# Altium schematic sheet Current Sensing.SchDoc
size A4; SheetNumber: 7; SheetTotal: 7
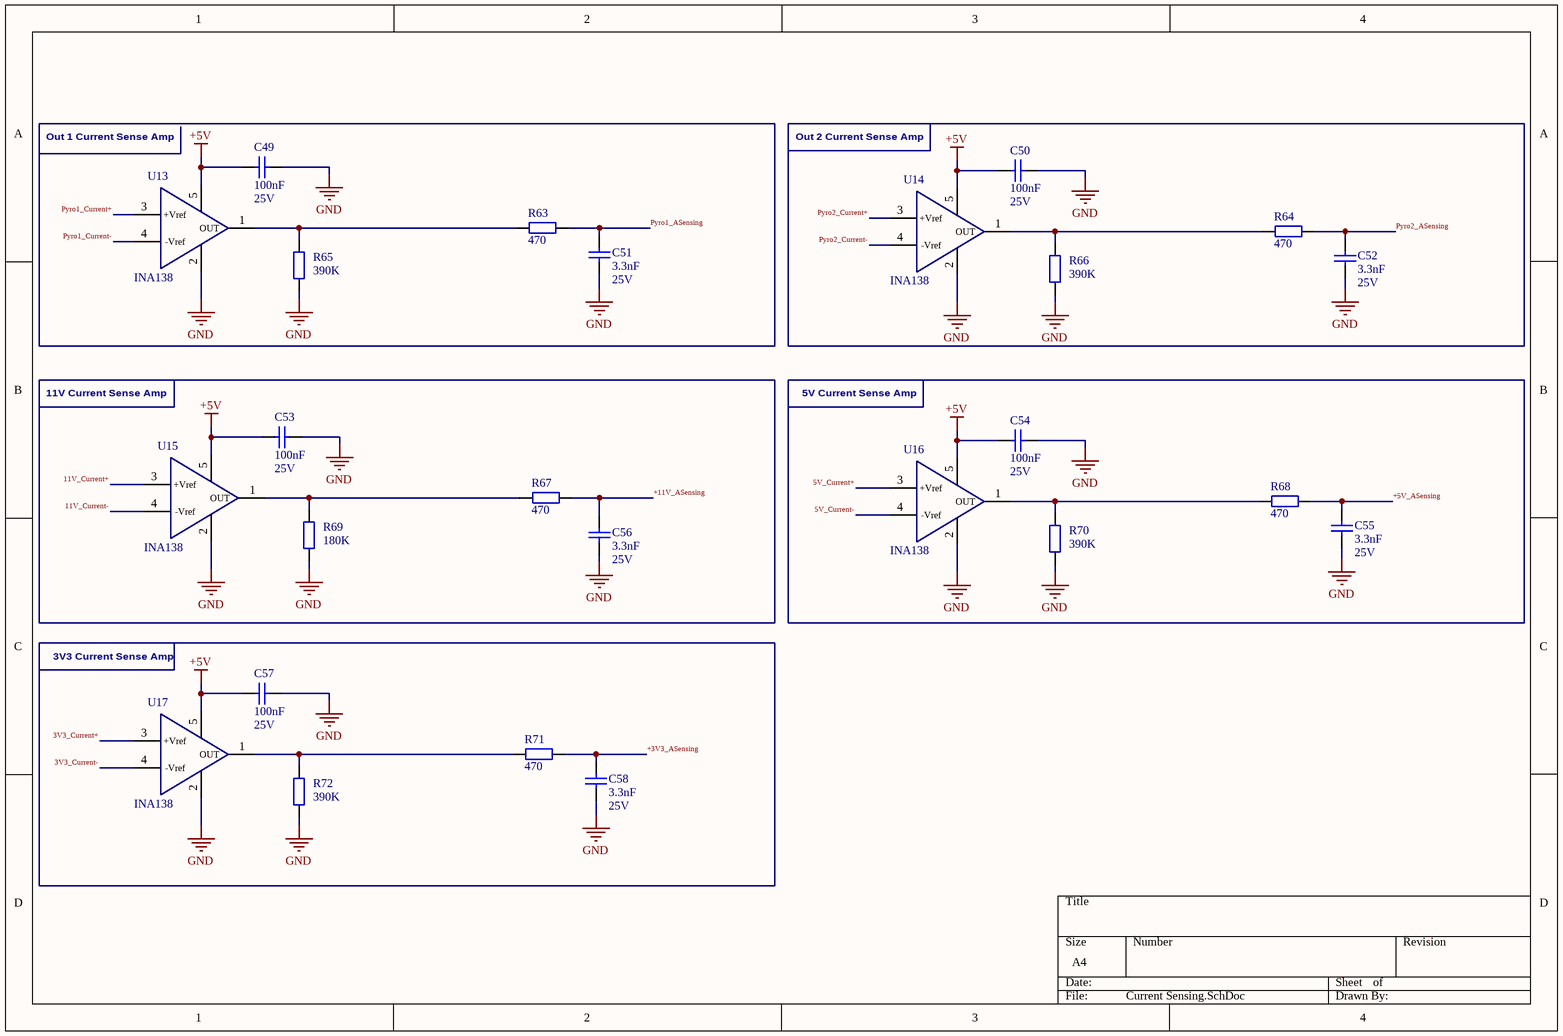
[diagram p0: Current Sensing.SchDoc]

## Parts
C49  value 100nF  Voltage: 25V  [MY_0603]  (hidden comment: Cap ceramic)
C50  value 100nF  Voltage: 25V  [MY_0603]  (hidden comment: Cap ceramic)
C51  value 3.3nF  Volte: 25V  [MY_0603]  (hidden comment: Cap ceramic)
C52  value 3.3nF  Volte: 25V  [MY_0603]  (hidden comment: Cap ceramic)
C53  value 100nF  Voltage: 25V  [MY_0603]  (hidden comment: Cap ceramic)
C54  value 100nF  Voltage: 25V  [MY_0603]  (hidden comment: Cap ceramic)
C55  value 3.3nF  Volte: 25V  [MY_0603]  (hidden comment: Cap ceramic)
C56  value 3.3nF  Volte: 25V  [MY_0603]  (hidden comment: Cap ceramic)
C57  value 100nF  Voltage: 25V  [MY_0603]  (hidden comment: Cap ceramic)
C58  value 3.3nF  Volte: 25V  [MY_0603]  (hidden comment: Cap ceramic)
R63  470  [R0603-0.45]
R64  470  [R0603-0.45]
R65  390K  [R0805-0.45]
R66  390K  [R0805-0.45]
R67  470  [R0603-0.45]
R68  470  [R0603-0.45]
R69  180K  [R0805-0.45]
R70  390K  [R0805-0.45]
R71  470  [R0603-0.45]
R72  390K  [R0805-0.45]
U13  INA138  [INA138-Footprint-1]
U14  INA138  [INA138-Footprint-1]
U15  INA138  [INA138-Footprint-1]
U16  INA138  [INA138-Footprint-1]
U17  INA138  [INA138-Footprint-1]

## Blocks framed on the sheet
Out 1 Current Sense Amp: C49 C51 R63 R65 U13
Out 2 Current Sense Amp: C50 C52 R64 R66 U14
11V Current Sense Amp: C53 C56 R67 R69 U15
5V Current Sense Amp: C54 C55 R68 R70 U16
3V3 Current Sense Amp: C57 C58 R71 R72 U17

## Nets
+5V: C49.2 C50.2 C53.2 C54.2 C57.2 U13.5(V+) U14.5(V+) U15.5(V+) U16.5(V+) U17.5(V+)
GND: C49.1 C50.1 C51.1 C52.1 C53.1 C54.1 C55.1 C56.1 C57.1 C58.1 R65.1 R66.1 R69.1 R70.1 R72.1 U13.2(GND) U14.2(GND) U15.2(GND) U16.2(GND) U17.2(GND)
3V3_Current+: U17.3(+Vref)
3V3_Current-: U17.4(-Vref)
5V_Current+: U16.3(+Vref)
5V_Current-: U16.4(-Vref)
11V_Current+: U15.3(+Vref)
11V_Current-: U15.4(-Vref)
+3V3_ASensing: C58.2 R71.1
+5V_ASensing: C55.2 R68.1
+11V_ASensing: C56.2 R67.1
Pyro1_ASensing: C51.2 R63.1
Pyro1_Current+: U13.3(+Vref)
Pyro1_Current-: U13.4(-Vref)
Pyro2_ASensing: C52.2 R64.1
Pyro2_Current+: U14.3(+Vref)
Pyro2_Current-: U14.4(-Vref)
NetR63_2: R63.2 R65.2 U13.1(OUT)
NetR64_2: R64.2 R66.2 U14.1(OUT)
NetR67_2: R67.2 R69.2 U15.1(OUT)
NetR68_2: R68.2 R70.2 U16.1(OUT)
NetR71_2: R71.2 R72.2 U17.1(OUT)

## Library data of the parts
C49 C50 C53 C54 C57 = CMP-015-000000-1: Capacitor, 100nF, 0603, 25V; Manufacturer: Wurth Elektronik; Manufacturer Part Number: 885012206071
  C49: ClassName: 1Pyro OPAMP
  C50: ClassName: 1PyroR OPAMP
  C53: ClassName: 11V OPAMP
  C54: ClassName: 5V OPAMP
  C57: ClassName: 3V3 OPAMP
C51 C52 C55 C56 C58 = CMP-015-000000-1: Capacitor, 3.3nF, 0603, 25V; Manufacturer: Wurth Elektronik; Manufacturer Part Number: 885012206062
R63 R64 R67 R68 R71 = CMP-009-000000-3: Resistor, 470R, 0603, 0.1W; Manufacturer: Wurth; Manufacturer Part Number: 560112116067; Power Disipation: 0.1W
R65 R66 R70 R72 = CMP-009-000000-3: Resistor, 400K, 0805, 125mW; Manufacturer: Wurth; Manufacturer Part Number: 560112116024; Power Disipation: 0.1W
  R65: ClassName: 1Pyro OPAMP
  R66: ClassName: 1PyroR OPAMP
  R70: ClassName: 5V OPAMP
  R72: ClassName: 3V3 OPAMP
R69 = CMP-009-000000-3: Resistor, 400K, 0805, 125mW; Manufacturer: Wurth; Manufacturer Part Number: 560112116072; Power Disipation: 0.1W; ClassName: 11V OPAMP
U13-U17 = CMP-014-00004-3: Shunt Current Measure Amplifier; Manufacturer: Texas Instruments; Manufacturer Part Number: INA138NA/3K
  U13: ClassName: 1Pyro OPAMP
  U14: ClassName: 1PyroR OPAMP
  U15: ClassName: 11V OPAMP
  U16: ClassName: 5V OPAMP
  U17: ClassName: 3V3 OPAMP